# EAGLE schematic decoder (EAGLE 7.2.0)
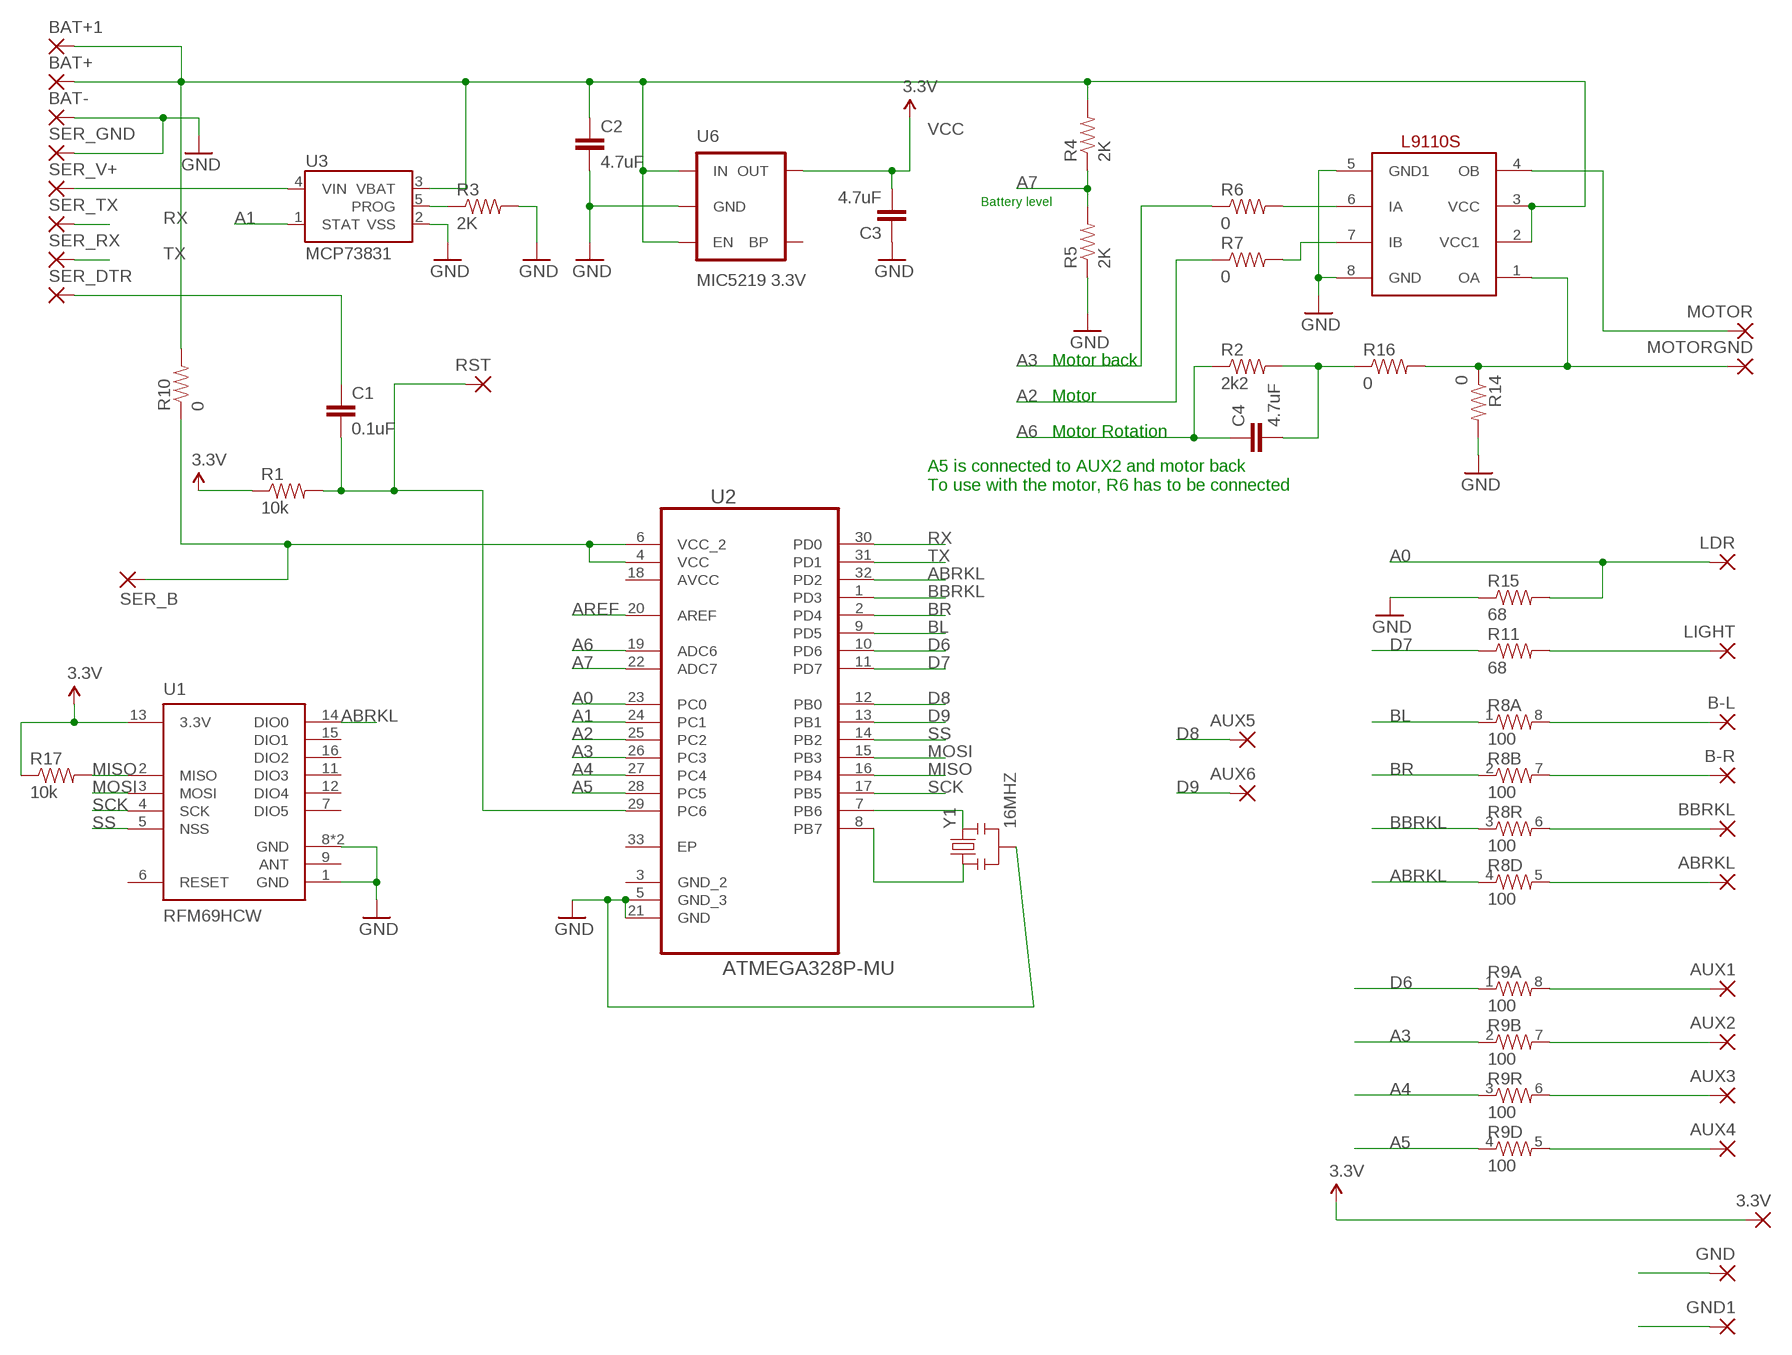
[diagram p0: schematic, sheet 1]

## Parts
3.3V  SMD2  [SMD1,27-2,54]
ABRKL  SMD2  [SMD1,27-2,54]
AUX1  SMD2  [SMD1,27-2,54]
AUX2  SMD2  [SMD1,27-2,54]
AUX3  SMD2  [SMD1,27-2,54]
AUX4  SMD2  [SMD1,27-2,54]
AUX5  SMD2  [SMD1,27-2,54]
AUX6  SMD2  [SMD1,27-2,54]
B-L  SMD2  [SMD1,27-2,54]
B-R  SMD2  [SMD1,27-2,54]
BAT+  SMD2  [SMD1,27-2,54]
BAT+1  SMD2  [SMD1,27-2,54]
BAT-  SMD2  [SMD1,27-2,54]
BBRKL  SMD2  [SMD1,27-2,54]
C1  0.1uF  CAP0805  [0805]
C2  4.7uF  CAP0805  [0805]
C3  4.7uF  CAP0805  [0805]
C4  4.7uF  CAP0805  [0805]
GND  SMD2  [SMD1,27-2,54]
GND1  SMD2  [SMD1,27-2,54]
LDR  SMD2  [SMD1,27-2,54]
LIGHT  SMD2  [SMD1,27-2,54]
MDRIVER  L9110S  [SO08]
MOTOR  SMD2  [SMD1,27-2,54]
MOTORGND  SMD2  [SMD1,27-2,54]
R1  10k  RESISTOR0603-RES  [0603-RES]
R2  2k2  RESISTOR0603-RES  [0603-RES]
R3  2K  RESISTOR0603-RES  [0603-RES]
R4  2K  RESISTOR0603-RES  [0603-RES]
R5  2K  RESISTOR0603-RES  [0603-RES]
R6  0  RESISTOR0603-RES  [0603-RES]
R7  0  RESISTOR0603-RES  [0603-RES]
R8  100  RESISTOR-ARRAY0603-ARV  [0603-ARV]
R9  100  RESISTOR-ARRAY0603-ARV  [0603-ARV]
R10  0  RESISTOR0603-RES  [0603-RES]
R11  68  RESISTOR0603-RES  [0603-RES]
R14  0  RESISTOR0603-RES  [0603-RES]
R15  68  RESISTOR0603-RES  [0603-RES]
R16  0  RESISTOR0603-RES  [0603-RES]
R17  10k  RESISTOR0603-RES  [0603-RES]
RST  SMD2  [SMD1,27-2,54]
SER_B  SMD2  [SMD1,27-2,54]
SER_DTR  SMD2  [SMD1,27-2,54]
SER_GND  SMD2  [SMD1,27-2,54]
SER_RX  SMD2  [SMD1,27-2,54]
SER_TX  SMD2  [SMD1,27-2,54]
SER_V+  SMD2  [SMD1,27-2,54]
U1  RFM69HCW  [RFM69HCW-XXXS2]
U2  ATMEGA328P-MU  [QFN50P500X500X100-33N]
U3  MCP73831  [SOT23-5]
U6  MIC5219 3.3V  V_REG_MIC52193.3V  [SOT23-5]
Y1  16MHZ  RESONATOR16MHZ  [RESONATOR-SMD]

## Nets
A0: LDR.1(P) R15.2 U2.23(PC0)
A1: U2.24(PC1) U3.1(STAT)
A2: R7.1 U2.25(PC2)
A3: R6.1 R9.2 U2.26(PC3)
A4: R9.3 U2.27(PC4)
A5: R9.4 U2.28(PC5)
A6: C4.1 R2.1 U2.19(ADC6)
A7: R4.1 R5.2 U2.22(ADC7)
ABRKL: R8.4 U1.14(DIO0) U2.32(PD2)
AREF: U2.20(AREF)
BAT+: BAT+1.1(P) BAT+.1(P) C2.1 MDRIVER.2(VCC1) MDRIVER.3(VCC) R4.2 R10.2 U3.3(VBAT) U6.1(IN) U6.3(EN)
BBRKL: R8.3 U2.1(PD3)
BL: R8.1 U2.9(PD5)
BR: R8.2 U2.2(PD4)
D6: R9.1 U2.10(PD6)
D7: R11.1 U2.11(PD7)
D8: AUX5.1(P) U2.12(PB0)
D9: AUX6.1(P) U2.13(PB1)
GND: BAT-.1(P) C2.2 C3.1 GND1.1(P) GND.1(P) MDRIVER.5(GND1) MDRIVER.8(GND) R3.2 R5.1 R14.2 R15.1 SER_GND.1(P) U1.1(GND) U1.8(GND) U1.10(GND) U2.5(GND_3) U2.21(GND) U3.2(VSS) U6.2(GND) Y1.2
MISO: R17.2 U1.2(MISO) U2.16(PB4)
MOSI: U1.3(MOSI) U2.15(PB3)
N$1: C4.2 R2.2 R16.1
N$2: U2.8(PB7) Y1.1
N$3: C1.1 SER_DTR.1(P)
N$4: U2.7(PB6) Y1.3
N$5: C1.2 R1.2 RST.1(P) U2.29(PC6)
N$6: MDRIVER.6(IA) R6.2
N$7: MDRIVER.7(IB) R7.2
N$8: R10.1 SER_B.1(P) U2.4(VCC) U2.6(VCC_2)
N$9: SER_V+.1(P) U3.4(VIN)
N$11: R3.1 U3.5(PROG)
N$12: LIGHT.1(P) R11.2
N$13: B-L.1(P) R8.8
N$16: B-R.1(P) R8.7
N$18: BBRKL.1(P) R8.6
N$20: ABRKL.1(P) R8.5
N$21: AUX1.1(P) R9.8
N$22: AUX2.1(P) R9.7
N$23: AUX3.1(P) R9.6
N$24: AUX4.1(P) R9.5
OA: MDRIVER.1(OA) MOTORGND.1(P) R14.1 R16.2
OB: MDRIVER.4(OB) MOTOR.1(P)
RX: SER_TX.1(P) U2.30(PD0)
SCK: U1.4(SCK) U2.17(PB5)
SS: U1.5(NSS) U2.14(PB2)
TX: SER_RX.1(P) U2.31(PD1)
VCC: 3.3V.1(P) C3.2 R1.1 R17.1 U1.13(3.3V) U6.5(OUT) ; supply symbol labelled 3.3V
Unconnected: U1.6(RESET) U1.7(DIO5) U1.9(ANT) U1.11(DIO3) U1.12(DIO4) U1.15(DIO1) U1.16(DIO2) U2.3(GND_2) U2.33(EP) U6.4(BP)

## Notes on the sheet
- Battery level
- Motor back
- Motor
- Motor Rotation
- A5 is connected to AUX2 and motor back
  To use with the motor, R6 has to be connected

## Power pins joined to a net without a drawn wire
AVCC: U2.18(AVCC)

## Library data of the parts
3.3V ABRKL AUX1-AUX6 B-L B-R BAT+ BAT+1 BAT- BBRKL GND GND1 LDR LIGHT MOTOR MOTORGND RST SER_B SER_DTR SER_GND SER_RX SER_TX SER_V+ = wirepad:SMD2: SMD PAD
C1-C4 = SparkFun-Capacitors:CAP: Capacitor Standard 0603 ceramic capacitor, and 0.1" leaded capacitor.
MDRIVER = h-bridge-l9119s:L9110S: H Bridge L9110s
R1-R7 R10 R11 R14-R17 = SparkFun-Resistors:RESISTOR: Resistor Basic schematic elements and footprints for 0603, 1206, and PTH resistors.
R8 R9 = SparkFun-Resistors:RESISTOR-ARRAY: Array Chip Resistor Source: RS Component / Phycomp
U1 = SparkFun-RF:RFM69H
U2 = Atmel_By_element14_Batch_1-00:ATMEGA328P-MU: Programmable Flash; MPN: ATMEGA328P-MU; OC_FARNELL: 1748522; OC_NEWARK: 26R2526; PACKAGE: QFN-32; SUPPLIER: Atmel
U3 = SparkFun-PowerIC:MCP73831: Miniature single cell, fully integrated Li-Ion, Li-polymer charge management controller http://ww1.microchip.com/downloads/en/DeviceDoc/21984a.pdf IC-09995; PROD_ID: IC-09995
U6 = SparkFun-PowerIC:V_REG_MIC5219: V_REG MIC5219 Standard 3.3V and 5V 500mA LDO voltage regulator in SOT-23 layout. Micrel part MIC5219. BP (by-pass) pin is used to lower output noise with 470pF cap, may be left open.; PROD_ID: VREG-09872
Y1 = SparkFun-FreqCtrl:RESONATOR: Resonator Small SMD resonator. Used, eg, on the Arduino Pro/ Pro Mini boards. 8MHz- XTAL-08895 16MHz- XTAL-08900; PROD_ID: XTAL-08900